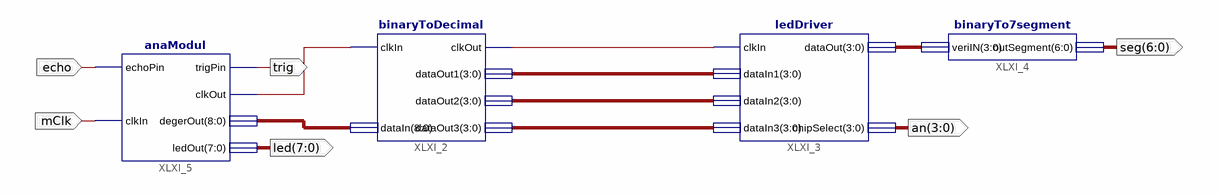
[diagram p0: schematic sheet 1]
// Xilinx ISE schematic anasema.sch (spartan3e) as structural Verilog: 4 symbols, 6 ports
module anasema (
  input  echo,
  input  mClk,
  output [3:0] an,
  output [6:0] seg,
  output trig,
  output [7:0] led
);

  wire XLXN_4, XLXN_5;
  wire [3:0] XLXN_1, XLXN_6, XLXN_7, XLXN_8;
  wire [8:0] XLXN_3;

  binaryToDecimal XLXI_2 (
    .clkIn(XLXN_4), .dataIn(XLXN_3), .clkOut(XLXN_5), .dataOut1(XLXN_6), .dataOut2(XLXN_7), .dataOut3(XLXN_8));
  ledDriver XLXI_3 (
    .clkIn(XLXN_5), .dataIn1(XLXN_6), .dataIn2(XLXN_7), .dataIn3(XLXN_8), .dataOut(XLXN_1), .chipSelect(an));
  binaryTo7segment XLXI_4 (.veriIN(XLXN_1), .outSegment(seg));
  anaModul XLXI_5 (.echoPin(echo), .clkIn(mClk), .trigPin(trig), .clkOut(XLXN_4), .degerOut(XLXN_3), .ledOut(led));
endmodule
